# EAGLE design ESP32-RFID IoT (EAGLE 9.6.2)
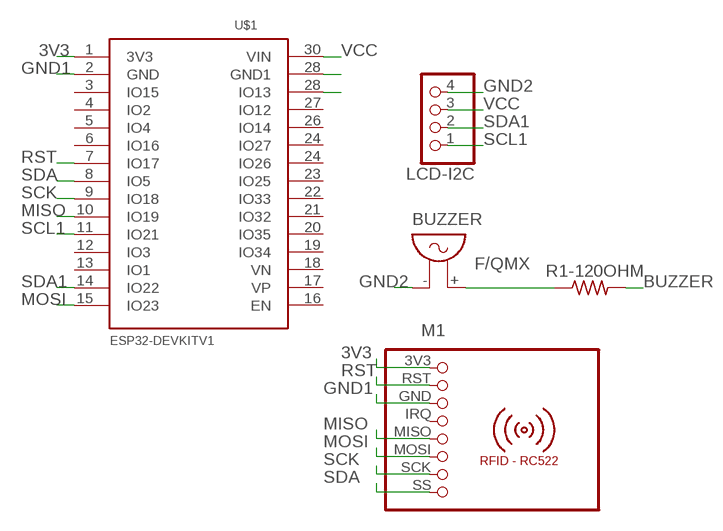
[diagram p0: schematic, sheet 1]

## Parts
BUZZER  F/QMX  [F/QMX]
LCD-I2C  PINHD-1X4  [1X04]
M1  RFID-RC522  [RFID-RC522]
R1-120OHM  R-US_0204/7  [0204/7]
U$1  ESP32DEVKITV1  [ESP32-DEVKITV1]

## Nets
3V3: M1.3V3 U$1.1(3V3)
BUZZER: R1-120OHM.2 U$1.28(IO13)
GND1: M1.GND U$1.2(GND)
GND2: BUZZER.- LCD-I2C.4 U$1.28(GND1)
MISO: M1.MISO U$1.10(IO19)
MOSI: M1.MOSI U$1.15(IO23)
N$1: BUZZER.+ R1-120OHM.1
RST: M1.RST U$1.7(IO17)
SCK: M1.SCK U$1.9(IO18)
SCL1: LCD-I2C.1 U$1.11(IO21)
SDA: M1.SS U$1.8(IO5)
SDA1: LCD-I2C.2 U$1.14(IO22)
VCC: LCD-I2C.3 U$1.30(VIN)
Unconnected: M1.IRQ U$1.3(IO15) U$1.4(IO2) U$1.5(IO4) U$1.6(IO16) U$1.12(IO3) U$1.13(IO1) U$1.16(EN) U$1.17(VP) U$1.18(VN) U$1.19(IO34) U$1.20(IO35) U$1.21(IO32) U$1.22(IO33) U$1.23(IO25) U$1.24(IO26) U$1.24(IO27) U$1.26(IO14) U$1.27(IO12)

## Library data of the parts
BUZZER = buzzer:F/QMX: BUZZER Source: Buerklin; OC_FARNELL: unknown; OC_NEWARK: unknown
LCD-I2C = pinhead:PINHD-1X4: PIN HEADER
M1 = mfrc522-module:RFID-RC522: RFID-RC522 MFRC-522 based breakout board
R1-120OHM = rcl:R-US_: RESISTOR, American symbol; SPICEPREFIX: R
U$1 = ESP32-DEVKITV1:ESP32DEVKITV1

## Board
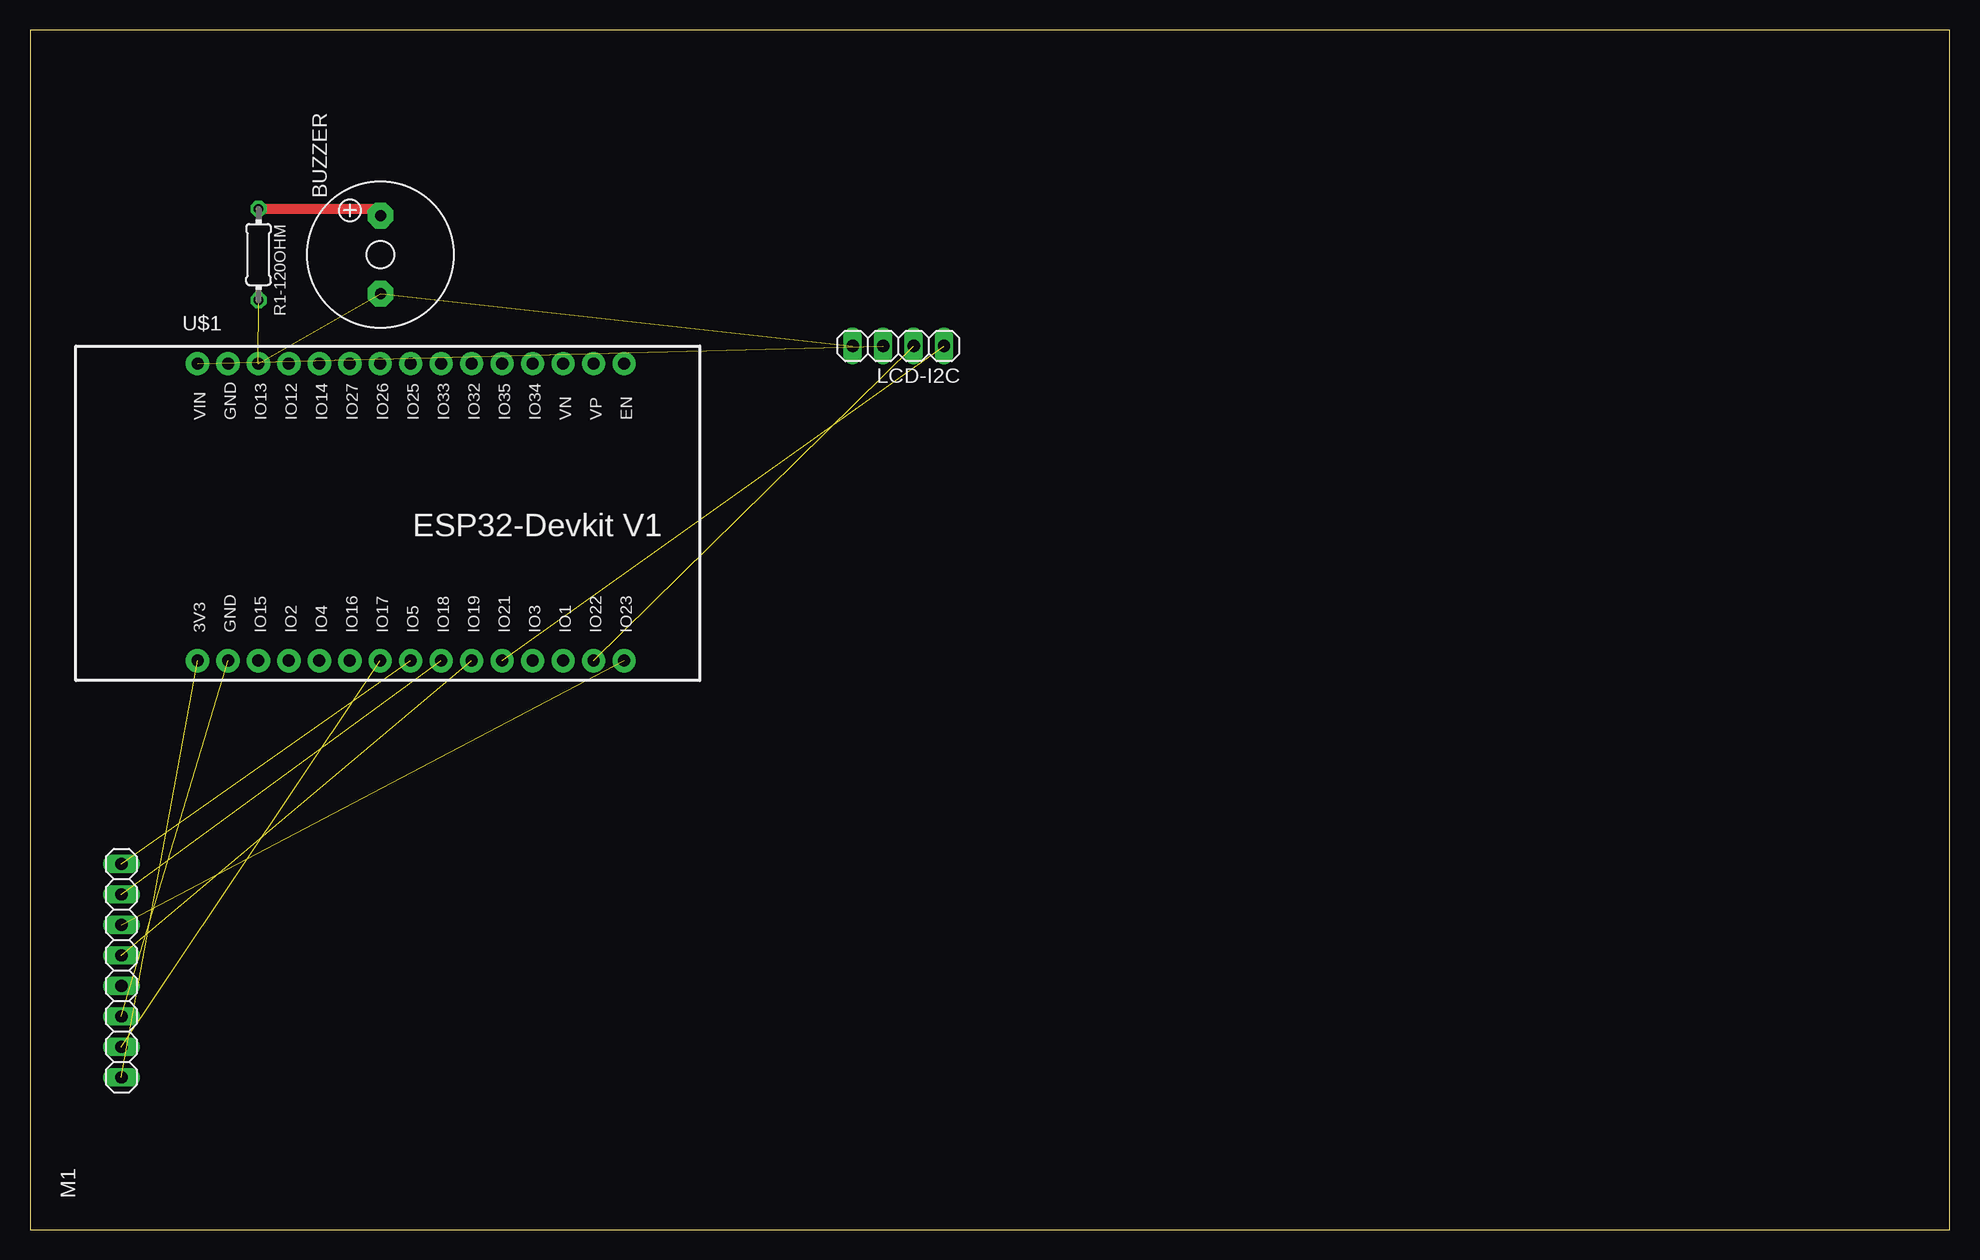
[diagram p1: board, top side]

Size 160 x 100 mm. Coordinates in mm from the lower left corner, seen from the top.
Outline: 0,0 160,0 160,100 0,100 0,0
Copper layers (1*16): Top 0.035mm / dielectric 1.5mm / Bottom 0.035mm
Design rules "default": minimum track width 6mil, minimum drill 0.35mm, track to track 6mil, track to pad 6mil, pad to pad 6mil, via to via 6mil, smd to smd 6mil, copper to edge 40mil, drill to drill 6mil, minimum pad ring 10mil, minimum via ring 8mil, stop-mask expansion 4mil, vias tented up to drill 0mil, thermal gap 10mil

### Footprints (pad centres in the part's own frame; a part is rotated, then mirrored left to right if it is on the bottom)
F/QMX = drill 0.914 pad 2.159 octagon: + 3.251,0; - -3.251,0
1X04 = drill 1.016 long: 1 -3.81,0; 2 -1.27,0; 3 1.27,0; 4 3.81,0
RFID-RC522 = drill 1.016 long: 3V3 -8.89,0; GND -3.81,0; IRQ -1.27,0; MISO 1.27,0; MOSI 3.81,0; RST -6.35,0; SCK 6.35,0; SS 8.89,0
0204/7 = drill 0.813 octagon: 1 -3.81,0; 2 3.81,0
ESP32-DEVKITV1 = drill 1 pad 1.93: 1 -22.87,-13.54; 2 -20.33,-13.54; 3 -17.79,-13.54; 4 -15.25,-13.54; 5 -12.71,-13.54; 6 -10.17,-13.54; 7 -7.63,-13.54; 8 -5.09,-13.54; 9 -2.55,-13.54; 10 -0.01,-13.54; 11 2.53,-13.54; 12 5.07,-13.54; 13 7.61,-13.54; 14 10.15,-13.54; 15 12.69,-13.54; 16 12.69,11.23; 17 10.15,11.23; 18 7.61,11.23; 19 5.07,11.23; 20 2.53,11.23; 21 -0.01,11.23; 22 -2.55,11.23; 23 -5.09,11.23; 24 -7.63,11.23; 25 -10.17,11.23; 26 -12.71,11.23; 27 -15.25,11.23; 28 -17.79,11.23; 29 -20.33,11.23; 30 -22.87,11.23

### Placement (x,y rotation side)
BUZZER  29.21,81.28 90 top
LCD-I2C  72.39,73.66 180 top
M1  7.62,21.59 90 top
R1-120OHM  19.05,81.28 270 top
U$1  36.83,60.96 0 top

### Tracks (layer width: path | path; a pad name or v marks a point on that pad's centre or on a via)
3V3  (1 unrouted)
BUZZER  (1 unrouted)
  Top 0.813: R1-120OHM.2
GND1  (1 unrouted)
GND2  (2 unrouted)
MISO  (1 unrouted)
MOSI  (1 unrouted)
N$1
  Top 0.813: BUZZER.+ 28.65,85.09 R1-120OHM.1
RST  (1 unrouted)
SCK  (1 unrouted)
SCL1  (1 unrouted)
SDA  (1 unrouted)
SDA1  (1 unrouted)
VCC  (1 unrouted)